# Altium schematic sheet LED.SchDoc
size A4
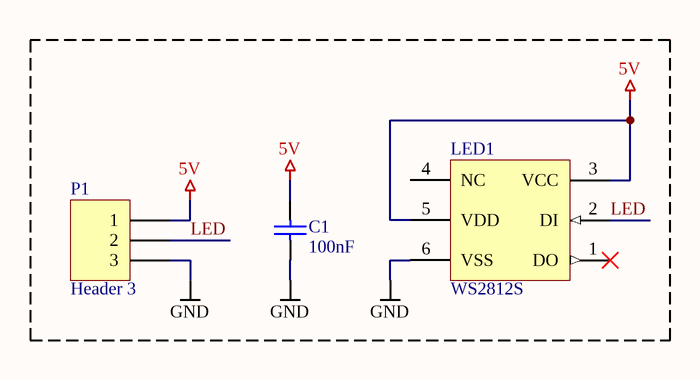
[diagram p0: LED.SchDoc]

## Parts
C1  100nF  [C0805]
LED1  WS2812S  [WS2812]
P1  Header 3  [MA03-1L]

## Nets
5V: C1.1 LED1.3(VCC) LED1.5(VDD) P1.1
GND: C1.2 LED1.6(VSS) P1.3
LED: LED1.2(DI) P1.2

Not connected (* = marked no-connect by the designer): LED1 1(DO)* 4(NC)

## Library data of the parts
C1 = Cap: Capacitor
LED1 = WS2812
P1 = Header 3: Header, 3-Pin